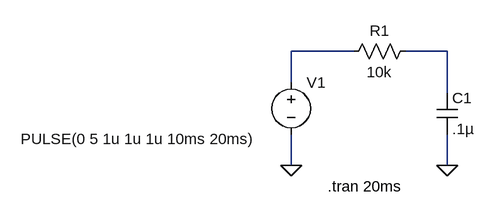
[diagram p0: schematic RC transient.asc]
RC transient.asc, the LTspice schematic file:
Version 4.1
SHEET 1 880 680
WIRE 112 48 16 48
WIRE 256 48 192 48
WIRE 16 96 16 48
WIRE 256 112 256 48
WIRE 16 224 16 176
WIRE 256 224 256 176
FLAG 16 224 0
FLAG 256 224 0
SYMBOL res 208 32 R90
WINDOW 0 0 56 VBottom 2
WINDOW 3 32 56 VTop 2
SYMATTR InstName R1
SYMATTR Value 10k
SYMBOL cap 240 112 R0
SYMATTR InstName C1
SYMATTR Value .1µ
SYMBOL voltage 16 80 R0
WINDOW 3 -416 103 Left 2
WINDOW 123 0 0 Left 0
WINDOW 39 0 0 Left 0
SYMATTR InstName V1
SYMATTR Value PULSE(0 5 1u 1u 1u 10ms 20ms)
TEXT 72 256 Left 2 !.tran 20ms

The netlist it stands for:
* RC transient.asc
R1 N002 N001 10k
C1 N002 0 .1µ
V1 N001 0 PULSE(0 5 1u 1u 1u 10ms 20ms)
.tran 20ms
.backanno
.end